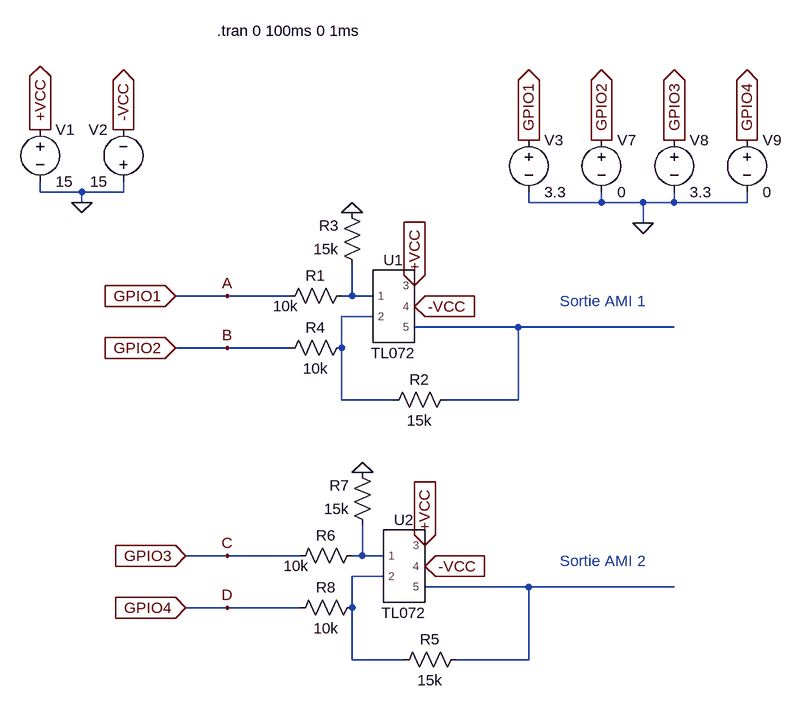
[diagram p0: schematic Emetteur_AMI.asc]
Emetteur_AMI.asc, the LTspice schematic file:
Version 4.1
SHEET 1 1860 960
WIRE -208 192 -208 176
WIRE -144 192 -208 192
WIRE -80 192 -80 176
WIRE -80 192 -144 192
WIRE -144 208 -144 192
WIRE 544 208 544 192
WIRE 656 208 656 192
WIRE 656 208 544 208
WIRE 720 208 656 208
WIRE 768 208 768 192
WIRE 768 208 720 208
WIRE 880 208 880 192
WIRE 880 208 768 208
WIRE 720 240 720 208
WIRE 80 352 0 352
WIRE 176 352 80 352
WIRE 272 352 272 304
WIRE 272 352 256 352
WIRE 304 352 272 352
WIRE 304 384 256 384
WIRE 528 400 368 400
WIRE 768 400 528 400
WIRE 80 432 0 432
WIRE 176 432 80 432
WIRE 256 432 256 384
WIRE 256 512 256 432
WIRE 336 512 256 512
WIRE 528 512 528 400
WIRE 528 512 416 512
WIRE 80 752 16 752
WIRE 192 752 80 752
WIRE 288 752 288 704
WIRE 288 752 272 752
WIRE 320 752 288 752
WIRE 320 784 272 784
WIRE 544 800 384 800
WIRE 768 800 544 800
WIRE 80 832 16 832
WIRE 192 832 80 832
WIRE 272 832 272 784
WIRE 272 912 272 832
WIRE 352 912 272 912
WIRE 544 912 544 800
WIRE 544 912 432 912
FLAG -144 208 0
FLAG -208 96 +VCC
IOPIN -208 96 Out
FLAG -80 96 -VCC
IOPIN -80 96 Out
FLAG 368 336 +VCC
IOPIN 368 336 In
FLAG 368 368 -VCC
IOPIN 368 368 In
FLAG 272 224 0
FLAG 384 736 +VCC
IOPIN 384 736 In
FLAG 384 768 -VCC
IOPIN 384 768 In
FLAG 288 624 0
FLAG 720 240 0
FLAG 544 112 GPIO1
IOPIN 544 112 Out
FLAG 656 112 GPIO2
IOPIN 656 112 Out
FLAG 768 112 GPIO3
IOPIN 768 112 Out
FLAG 880 112 GPIO4
IOPIN 880 112 Out
FLAG 0 352 GPIO1
IOPIN 0 352 In
FLAG 0 432 GPIO2
IOPIN 0 432 In
FLAG 16 752 GPIO3
IOPIN 16 752 In
FLAG 16 832 GPIO4
IOPIN 16 832 In
FLAG 80 352 A
FLAG 80 432 B
FLAG 80 752 C
FLAG 80 832 D
SYMBOL TL072 336 368 R0
SYMATTR InstName U1
SYMBOL voltage -208 80 R0
SYMATTR InstName V1
SYMATTR Value 15
SYMBOL voltage -80 192 R180
WINDOW 0 24 96 Left 2
WINDOW 3 24 16 Left 2
SYMATTR InstName V2
SYMATTR Value 15
SYMBOL res 432 496 R90
WINDOW 0 0 56 VBottom 2
WINDOW 3 32 56 VTop 2
SYMATTR InstName R2
SYMATTR Value 15k
SYMBOL res 272 336 R90
WINDOW 0 0 56 VBottom 2
WINDOW 3 16 102 VTop 2
SYMATTR InstName R1
SYMATTR Value 10k
SYMBOL res 288 320 R180
WINDOW 0 36 76 Left 2
WINDOW 3 36 40 Left 2
SYMATTR InstName R3
SYMATTR Value 15k
SYMBOL res 272 416 R90
WINDOW 0 0 56 VBottom 2
WINDOW 3 32 56 VTop 2
SYMATTR InstName R4
SYMATTR Value 10k
SYMBOL TL072 352 768 R0
SYMATTR InstName U2
SYMBOL res 448 896 R90
WINDOW 0 0 56 VBottom 2
WINDOW 3 32 56 VTop 2
SYMATTR InstName R5
SYMATTR Value 15k
SYMBOL res 288 736 R90
WINDOW 0 0 56 VBottom 2
WINDOW 3 16 102 VTop 2
SYMATTR InstName R6
SYMATTR Value 10k
SYMBOL res 304 720 R180
WINDOW 0 36 76 Left 2
WINDOW 3 36 40 Left 2
SYMATTR InstName R7
SYMATTR Value 15k
SYMBOL res 288 816 R90
WINDOW 0 0 56 VBottom 2
WINDOW 3 32 56 VTop 2
SYMATTR InstName R8
SYMATTR Value 10k
SYMBOL voltage 544 96 R0
SYMATTR InstName V3
SYMATTR Value 3.3
SYMBOL voltage 656 96 R0
SYMATTR InstName V7
SYMATTR Value 0
SYMBOL voltage 768 96 R0
SYMATTR InstName V8
SYMATTR Value 3.3
SYMBOL voltage 880 96 R0
SYMATTR InstName V9
SYMATTR Value 0
TEXT 64 -56 Left 2 !.tran 0 100ms 0 1ms
TEXT 592 360 Left 2 ;Sortie AMI 1
TEXT 592 760 Left 2 ;Sortie AMI 2

The netlist it stands for:
* Emetteur_AMI.asc
X§U1 N001 N002 +VCC -VCC N003 TL072  ; pins 1 2 3 4 5
V1 +VCC 0 15
V2 0 -VCC 15
R2 N003 N002 15k
R1 N001 A 10k
R3 N001 0 15k
R4 N002 B 10k
X§U2 N004 N005 +VCC -VCC N006 TL072  ; pins 1 2 3 4 5
R5 N006 N005 15k
R6 N004 C 10k
R7 N004 0 15k
R8 N005 D 10k
V3 A 0 3.3
V7 B 0 0
V8 C 0 3.3
V9 D 0 0
.tran 0 100ms 0 1ms
* Sortie AMI 1
* Sortie AMI 2
.lib D:\M2 SME\test\TL072.301
.backanno
.end